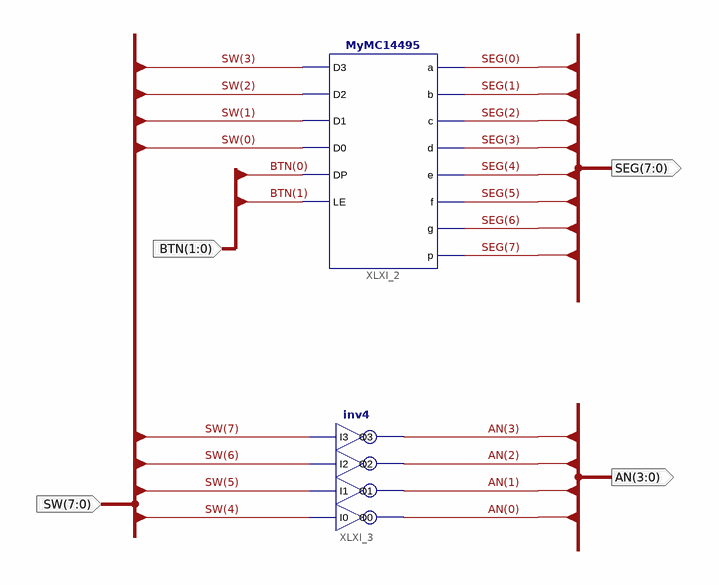
[diagram p0: schematic sheet 1]
// Xilinx ISE schematic DispNumber_sch.sch (kintex7) as structural Verilog: 2 symbols, 4 ports
module DispNumber_sch (
  input  [7:0] SW,
  input  [1:0] BTN,
  output [3:0] AN,
  output [7:0] SEG
);

  MyMC14495 XLXI_2 (
    .a(SEG[0]), .b(SEG[1]), .c(SEG[2]), .d(SEG[3]), .D0(SW[0]), .D1(SW[1]), .D2(SW[2]), .D3(SW[3]),
    .DP(BTN[0]), .e(SEG[4]), .f(SEG[5]), .g(SEG[6]), .LE(BTN[1]), .p(SEG[7]));
  inv4 XLXI_3 (.I0(SW[4]), .I1(SW[5]), .I2(SW[6]), .I3(SW[7]), .O0(AN[0]), .O1(AN[1]), .O2(AN[2]), .O3(AN[3]));
endmodule
